# Altium schematic sheet Main Sheet.SchDoc
size A; CompanyName: Microchip Technology Inc.; Organization: Microchip Technology; Address1: 2355 West Chandler Blvd.; Address2: Chandler, AZ  85224; Address4: USA; DocumentNumber: 1; SheetNumber: 1; SheetTotal: 5; SheetTitle: Main Sheet; Time: Time
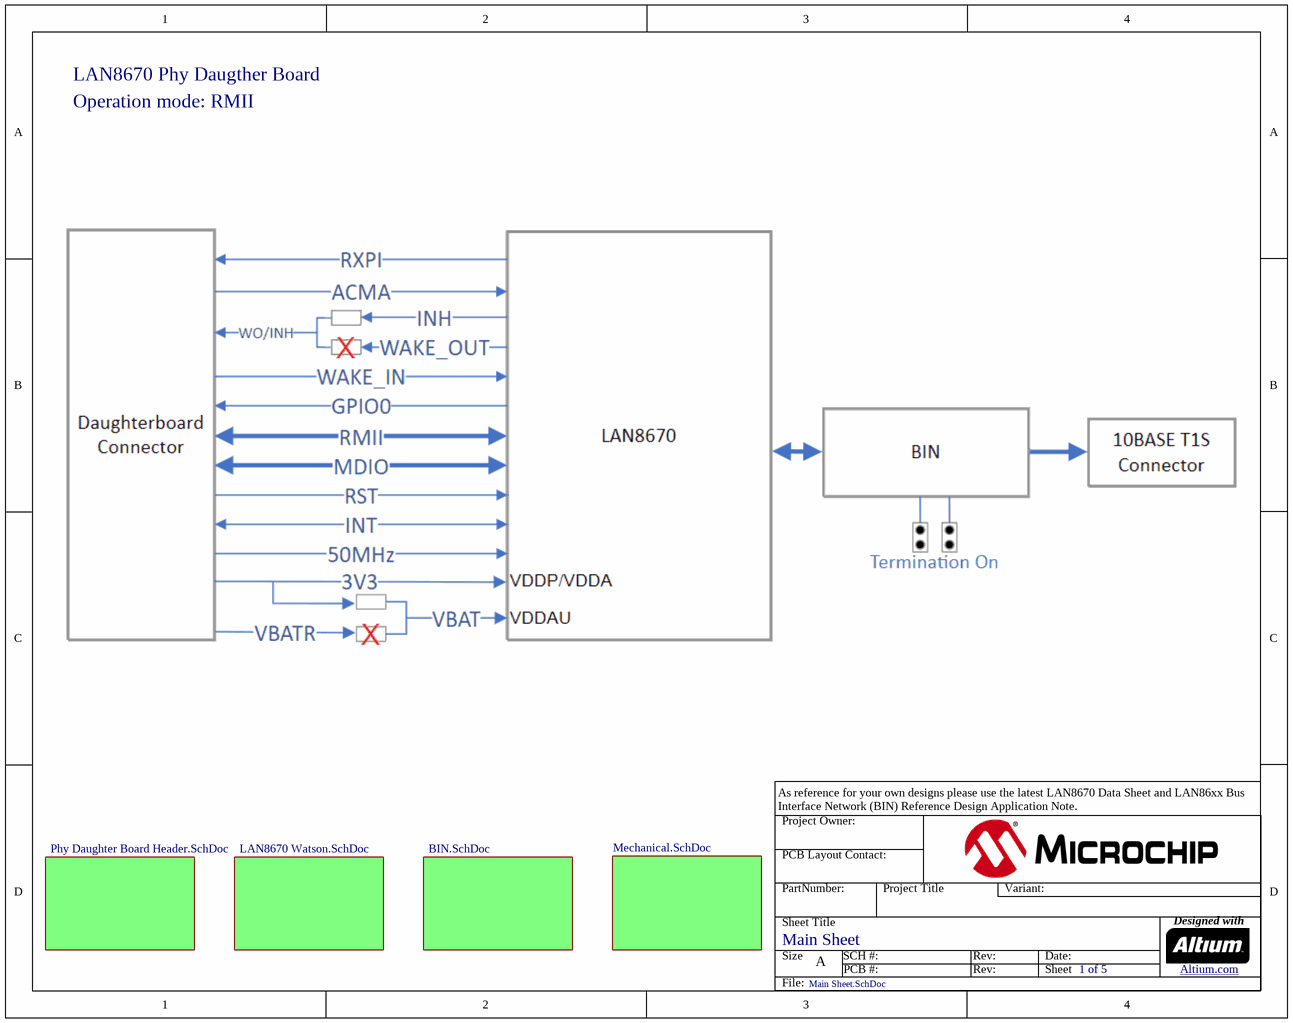
[diagram p0: Main Sheet.SchDoc]

## Sub-sheets
? = BIN.SchDoc: no entries
? = Phy Daughter Board Header.SchDoc: no entries
? = LAN8670 Watson.SchDoc: no entries
? = Mechanical.SchDoc: no entries

## Notes on the sheet
- LAN8670 Phy Daugther Board
- Operation mode: RMII
- As reference for your own designs please use the latest LAN8670 Data Sheet and LAN86xx Bus Interface Network (BIN) Reference Design Application Note.
- Project Owner:
- PCB Layout Contact:
- PartNumber:
- Project Title
- Variant:
- Sheet Title
- Size
- A
- SCH #:
- PCB #:
- Rev:
- Date:
- Sheet
- Designed with
- Altium.com <http://go.altium.com/MicrochipLandingPage_Evaluation.html>
- File: